# EAGLE design user_interface_bf_2.2.1 (EAGLE 7.7.0)
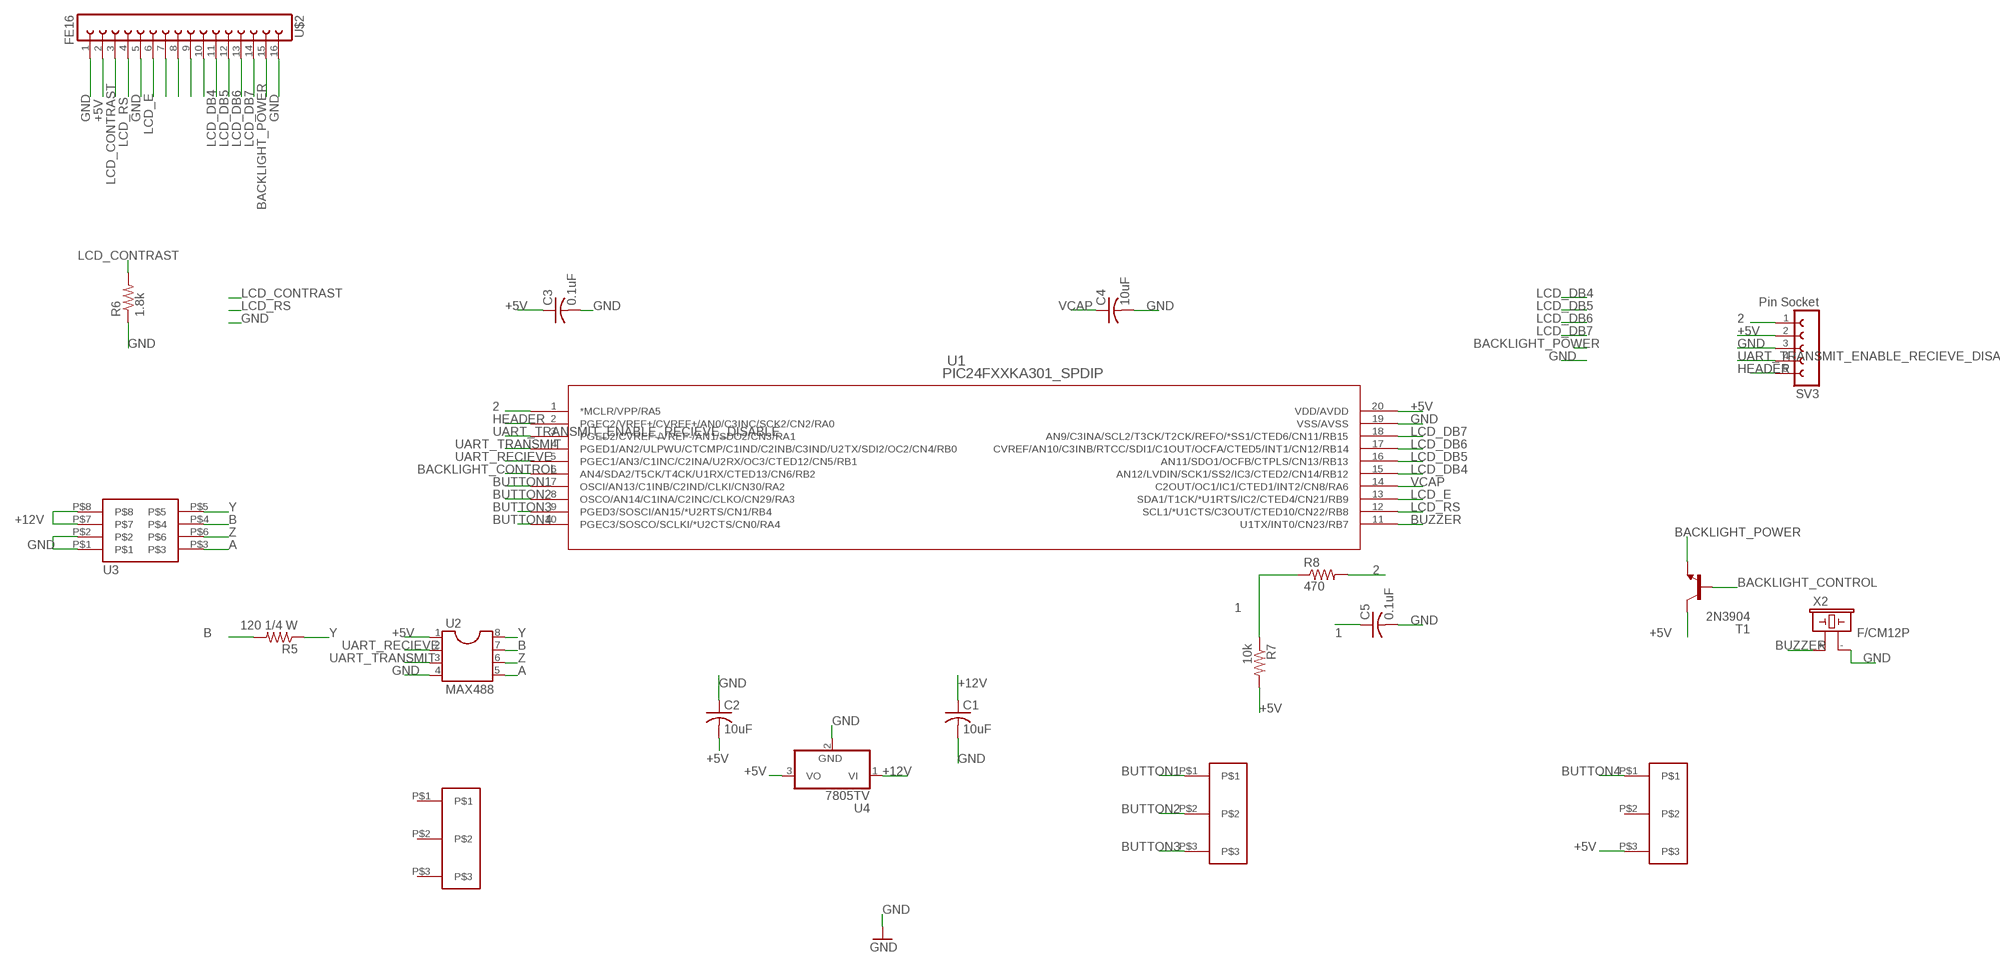
[diagram p0: schematic, sheet 1]

## Parts
C1  10uF  C-US050-025X075  [C050-025X075]
C2  10uF  C-US050-025X075  [C050-025X075]
C3  0.1uF  C-US050-025X075  [C050-025X075]
C4  10uF  C-US050-025X075  [C050-025X075]
C5  0.1uF  C-US050-025X075  [C050-025X075]
R5  120 1/4 W  R-US_0207/10  [0207/10]
R6  1.8k  R-US_0207/10  [0207/10]
R7  10k  R-US_0207/10  [0207/10]
R8  470  R-US_0207/10  [0207/10]
SV3  Pin Socket  FE05-1  [FE05-1]
T1  2N3904  [TO92]
U1  PIC24FXXKA301_SPDIP  [SPDIP20_300MC]
U2  MAX488  DIL8  [DIL08]
U3  CAT5  [CAT5]
U4  7805TV  [TO220V]
U6  3_PIN_FEMALE_HEADER  [3_PIN_FEMALE_HEADER]
U7  3_PIN_FEMALE_HEADER  [3_PIN_FEMALE_HEADER]
U$2  FE16  [FE16]
U$4  3_PIN_FEMALE_HEADER  [3_PIN_FEMALE_HEADER]
X2  F/CM12P  [F/CM12P]

## Nets
1: C5.1 R7.1 R8.1
2: R8.2 SV3.1 U1.1(*MCLR/VPP/RA5)
+5V: C2.2 C3.1 R7.2 SV3.2 T1.1(C) U1.20(VDD/AVDD) U2.1 U4.3(VO) U7.P$3 U$2.2
+12V: C1.1 U3.P$7 U3.P$8 U4.1(VI)
A: U2.5 U3.P$3
B: R5.2 U2.7 U3.P$4
BACKLIGHT_CONTROL: T1.2(B) U1.6(AN4/SDA2/T5CK/T4CK/U1RX/CTED13/CN6/RB2)
BACKLIGHT_POWER: T1.3(E) U$2.15
BUTTON1: U1.7(OSCI/AN13/C1INB/C2IND/CLKI/CN30/RA2) U6.P$1
BUTTON2: U1.8(OSCO/AN14/C1INA/C2INC/CLKO/CN29/RA3) U6.P$2
BUTTON3: U1.9(PGED3/SOSCI/AN15/*U2RTS/CN1/RB4) U6.P$3
BUTTON4: U1.10(PGEC3/SOSCO/SCLKI/*U2CTS/CN0/RA4) U7.P$1
BUZZER: U1.11(U1TX/INT0/CN23/RB7) X2.+
GND: C1.2 C2.1 C3.2 C4.2 C5.2 R6.1 SV3.3 U1.19(VSS/AVSS) U2.4 U3.P$1 U3.P$2 U4.2(GND) U$2.1 U$2.5 U$2.16 X2.-
HEADER: SV3.5 U1.2(PGEC2/VREF+/CVREF+/AN0/C3INC/SCK2/CN2/RA0)
LCD_CONTRAST: R6.2 U$2.3
LCD_DB4: U1.15(AN12/LVDIN/SCK1/SS2/IC3/CTED2/CN14/RB12) U$2.11
LCD_DB5: U1.16(AN11/SDO1/OCFB/CTPLS/CN13/RB13) U$2.12
LCD_DB6: U1.17(CVREF/AN10/C3INB/RTCC/SDI1/C1OUT/OCFA/CTED5/INT1/CN12/RB14) U$2.13
LCD_DB7: U1.18(AN9/C3INA/SCL2/T3CK/T2CK/REFO/*SS1/CTED6/CN11/RB15) U$2.14
LCD_E: U1.13(SDA1/T1CK/*U1RTS/IC2/CTED4/CN21/RB9) U$2.6
LCD_RS: U1.12(SCL1/*U1CTS/C3OUT/CTED10/CN22/RB8) U$2.4
N$12: U$2.10
N$13: U$2.9
N$14: U$2.8
N$15: U$2.7
UART_RECIEVE: U1.5(PGEC1/AN3/C1INC/C2INA/U2RX/OC3/CTED12/CN5/RB1) U2.2
UART_TRANSMIT: U1.4(PGED1/AN2/ULPWU/CTCMP/C1IND/C2INB/C3IND/U2TX/SDI2/OC2/CN4/RB0) U2.3
UART_TRANSMIT_ENABLE_RECIEVE_DISABLE: SV3.4 U1.3(PGED2/CVREF-/VREF-/AN1/SDO2/CN3/RA1)
VCAP: C4.1 U1.14(C2OUT/OC1/IC1/CTED1/INT2/CN8/RA6)
Y: R5.1 U2.8 U3.P$5
Z: U2.6 U3.P$6
Unconnected: U7.P$2 U$4.P$1 U$4.P$2 U$4.P$3

## Notes on the sheet
- U3

## Library data of the parts
C1-C5 = rcl:C-US: CAPACITOR, American symbol
R5-R8 = resistor:R-US_: RESISTOR, American symbol
SV3 = con-lsta:FE05-1: FEMALE HEADER; OC_FARNELL: unknown; OC_NEWARK: unknown
T1 = transistor:2N3904: NPN TRANSISTOR
U1 = KWHr Library:PIC24FXXKA301_SPDIP
U2 = ic-package:DIL8: Dual In Line / Socket
U3 = .KWHR Library:CAT5
U4 = linear:78*: Positive VOLTAGE REGULATOR Source: http://cache.national.com/ds/LM/LM78L05.pdf http://www.fairchildsemi.com/ds/LM/LM7805.pdf
U6 U7 U$4 = KWHr Library:3_PIN_FEMALE_HEADER
U$2 = con-lsta:FE16: FEMALE HEADER
X2 = buzzer:F/CM12P: BUZZER Source: Buerklin; OC_FARNELL: unknown; OC_NEWARK: unknown

## Board
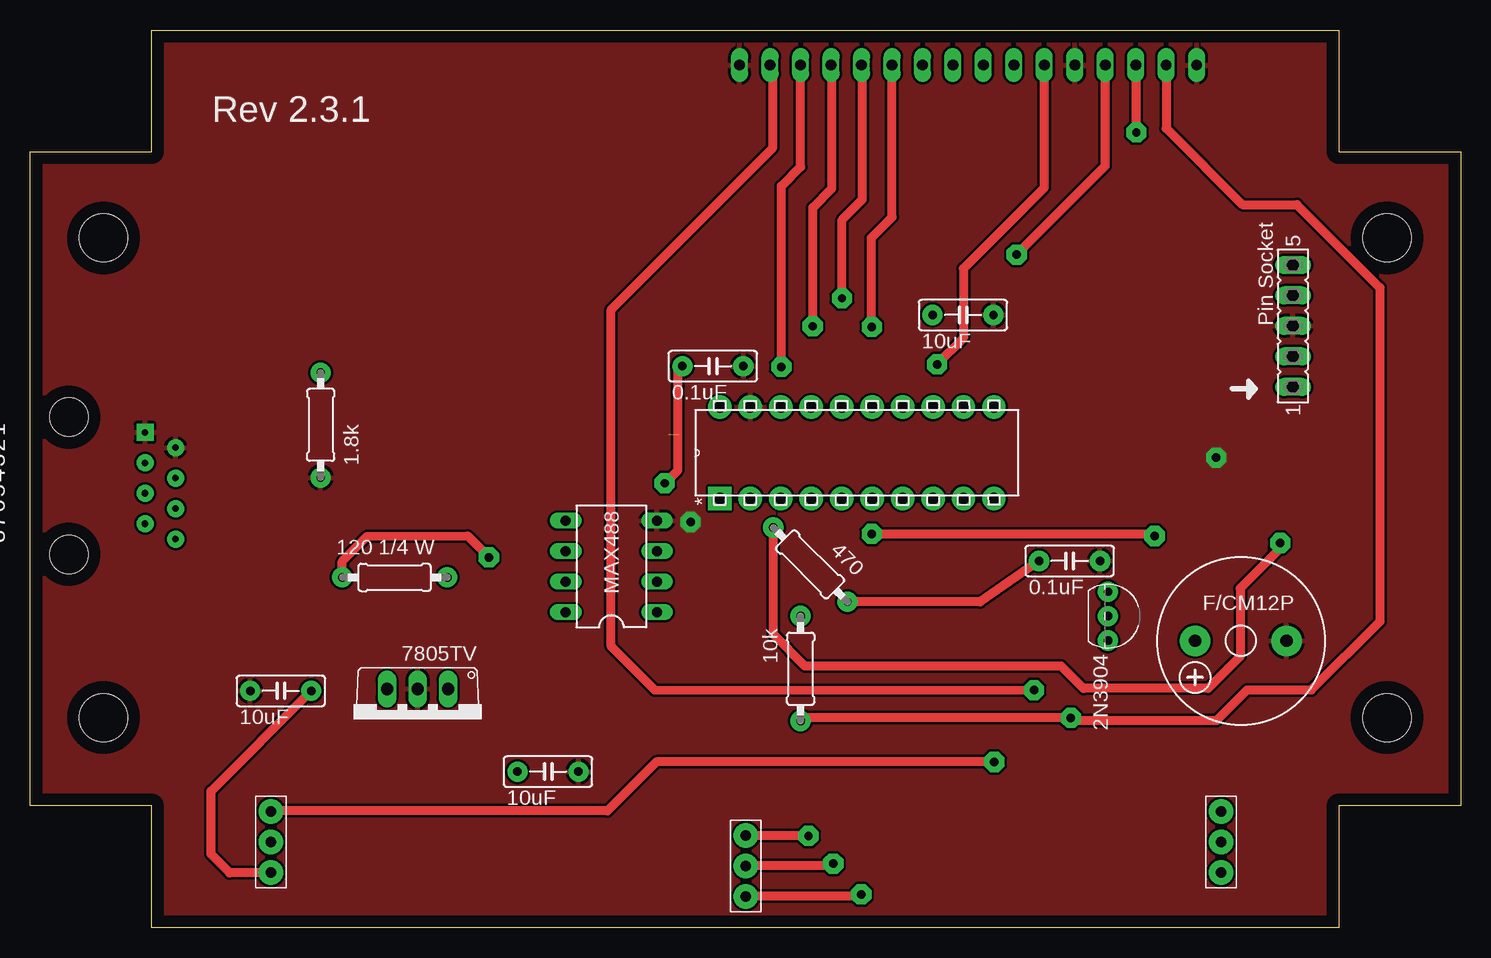
[diagram p1: board, top side]
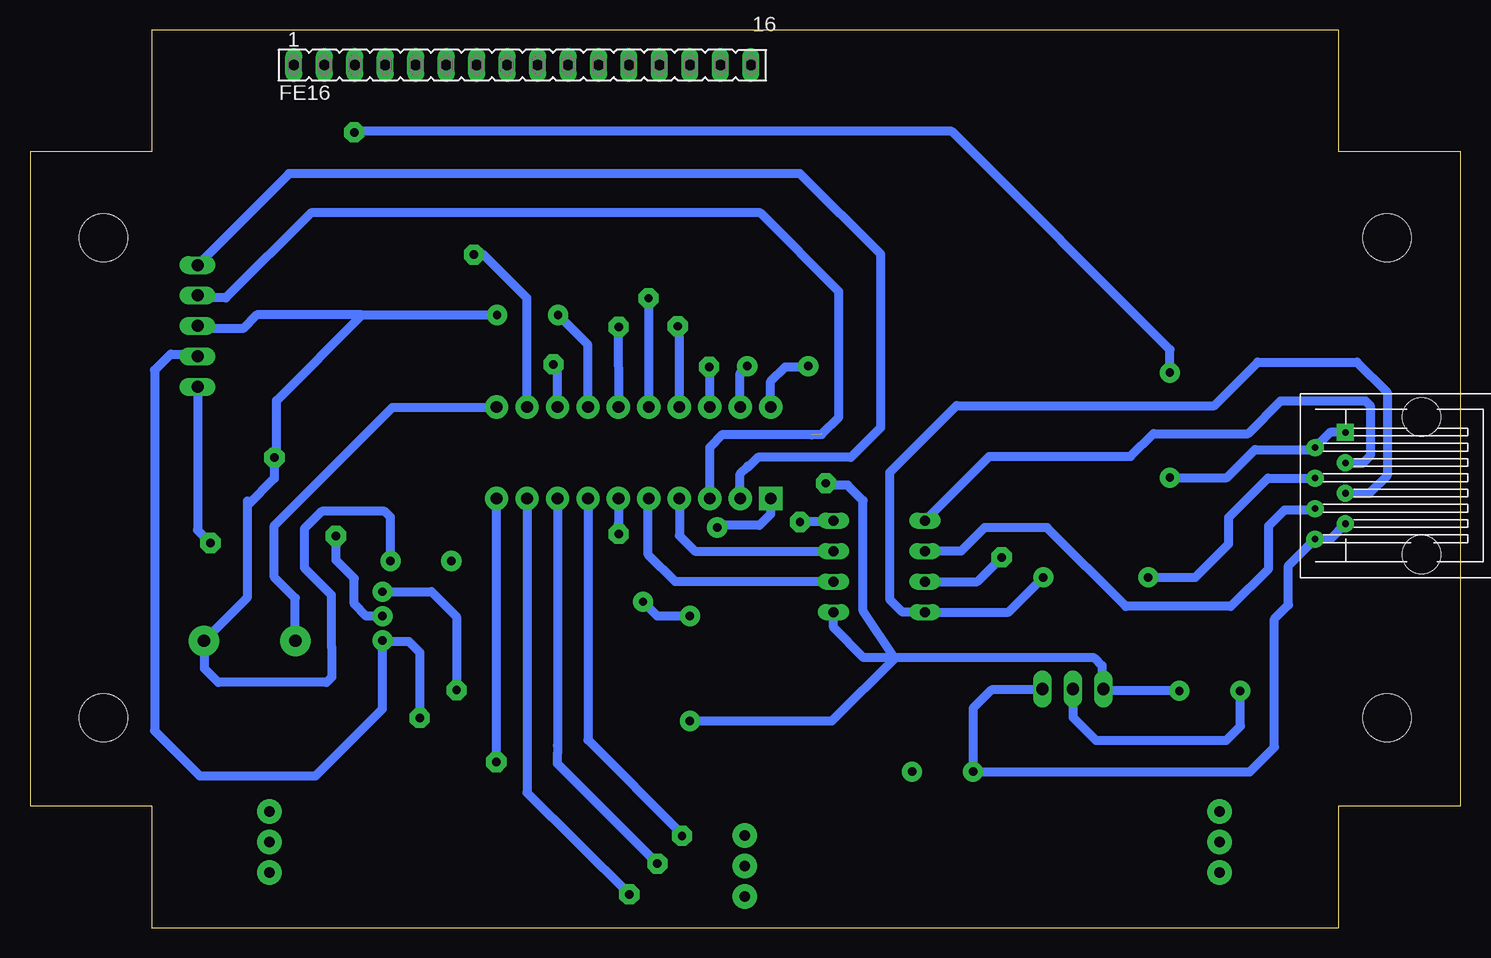
[diagram p2: board, bottom side, seen from below]

Size 119.25 x 74.8 mm. Coordinates in mm from the lower left corner, seen from the top.
Outline: 10.16,0 10.16,10.16 0,10.16 0,64.64 10.16,64.64 10.16,74.8 109.09,74.8 109.09,64.64 119.25,64.64 119.25,10.16 109.09,10.16 109.09,0 10.16,0
Copper layers (1*16): Top 0.035mm / dielectric 1.5mm / Bottom 0.035mm
Design rules "default": minimum track width 10mil, minimum drill 24mil, track to track 8mil, track to pad 8mil, pad to pad 8mil, via to via 8mil, smd to smd 8mil, copper to edge 40mil, drill to drill 8mil, minimum pad ring 10mil, minimum via ring 8mil, stop-mask expansion 4mil, vias tented up to drill 0mil, thermal gap 10mil
Holes 4 mm at 6.13,17.5 6.13,57.48 113.13,57.48 113.13,17.5

### Footprints (pad centres in the part's own frame; a part is rotated, then mirrored left to right if it is on the bottom)
C050-025X075 = drill 0.7 pad 1.676: 1 -2.54,0; 2 2.54,0
0207/10 = drill 0.7 pad 1.676: 1 -4.559,0; 2 4.191,0
FE05-1 = drill 1 long: 1 -5.08,0; 2 -2.54,0; 3 0,0; 4 2.54,0; 5 5.08,0
TO92 = drill 0.7 pad 1.676: 1 2.032,0; 2 0,0; 3 -2.032,0
SPDIP20_300MC = drill 0.991 pad 1.93 square: 1 -7.62,22.86 | drill 0.991 pad 1.93: 2 -7.62,20.32; 3 -7.62,17.78; 4 -7.62,15.24; 5 -7.62,12.7; 6 -7.62,10.16; 7 -7.62,7.62; 8 -7.62,5.08; 9 -7.62,2.54; 10 -7.62,0; 11 0,0; 12 0,2.54; 13 0,5.08; 14 0,7.62; 15 0,10.16; 16 0,12.7; 17 0,15.24; 18 0,17.78; 19 0,20.32; 20 0,22.86
DIL08 = drill 0.813 long: 1 -3.81,-3.81; 2 -1.27,-3.81; 3 1.27,-3.81; 4 3.81,-3.81; 5 3.81,3.81; 6 1.27,3.81; 7 -1.27,3.81; 8 -3.81,3.81
CAT5 = drill 0.56 pad 1.422 square: P$1 9.495,3.77 | drill 0.56 pad 1.422: P$2 8.225,1.23; P$3 6.955,3.77; P$4 5.685,1.23; P$5 4.415,3.77; P$6 3.145,1.23; P$7 1.875,3.77; P$8 0.605,1.23 | hole 3.2: -0.665,10.12; 10.765,10.12
TO220V = drill 1.016 long: 1 -2.54,-2.54; 2 0,-2.54; 3 2.54,-2.54
3_PIN_FEMALE_HEADER = drill 0.889 pad 2.032: P$1 0,0; P$2 2.54,0; P$3 5.08,0
FE16 = drill 0.9 long: 1 -25.4,2.54; 2 -22.86,2.54; 3 -20.32,2.54; 4 -17.78,2.54; 5 -15.24,2.54; 6 -12.7,2.54; 7 -10.16,2.54; 8 -7.62,2.54; 9 -5.08,2.54; 10 -2.54,2.54; 11 0,2.54; 12 2.54,2.54; 13 5.08,2.54; 14 7.62,2.54; 15 10.16,2.54; 16 12.7,2.54
F/CM12P = drill 1.016 pad 2.54: + 3.81,0; - -3.81,0

### Placement (x,y rotation side)
C1  43.18,13 0 top
C2  20.9,19.74 0 top
C3  56.92,46.79 0 top
C4  77.77,51.05 0 top
C5  86.66,30.56 0 top
R5  30.23,29.18 180 top
R6  24.23,42.06 90 top
R7  64.24,21.41 270 top
R8  64.92,30.38 135 top
SV3  105.28,50.14 90 top
T1  89.87,25.96 270 top
U1  80.37,43.38 90 top
U2  48.46,30.1 90 top
U3  13.36,31.78 90 top
U4  32.31,17.35 180 top
U6  59.68,7.68 270 top
U7  20.07,9.68 270 top
U$2  71.86,69.34 0 bottom
U$4  99.3,9.68 270 top
X2  100.94,23.9 180 top

### Tracks (layer width: path | path; a pad name or v marks a point on that pad's centre or on a via)
1
  Top 0.762: C5.1 79.2,27.15 R8.1
  Bottom 0.762: R8.1 66.96,25.97 R7.1
2  (via drill 0.7 pad 1.68)
  Top 0.762: v104.22,32.05 104.44,31.83 100.89,28.27 100.89,22.61 98.22,19.94 87.83,19.94 85.98,21.79 64.62,21.79 61.96,24.45 R8.2
  Bottom 0.762: SV3.1 105.28,33.12 v104.22,32.05 | U1.1 57.51,34.47 58.45,33.53 61.77,33.53 R8.2
+5V  (via drill 0.7 pad 1.68)
  Top 0.406: U7.P$3 20.34,4.6 20.34,4.57
  Top 0.762: v52.91,37.03 54,38.12 54,46.41 C3.1 | R7.2 64.49,17.48 v86.77,17.48 87,17.25 98.91,17.25 101.47,19.81 106.83,19.81 112.52,25.5 112.52,53.34 105.61,60.25 101.07,60.25 94.72,66.6 U$2.2 | 20.34,4.57 16.64,4.57 15.09,6.12 15.09,11.38 C2.2
  Bottom 0.762: 47.12,22.5 47.19,22.5 | 47.19,22.5 49.76,22.5 52.27,25.02 U2.1 | 47.19,22.5 49.81,26.39 49.81,35.59 51.1,36.88 52.76,36.88 v52.91,37.03 | 47.12,22.5 47.09,22.48 30.53,22.48 29.9,21.84 29.9,20.02 U4.3 29.62,19.74 C2.2 | R7.2 52.4,17.22 47.12,22.5 | U1.20 57.51,45.52 56.29,46.74 54.43,46.74 C3.1 | v86.77,17.48 86.77,22.94 87.68,23.85 89.79,23.85 T1.1 89.86,18.24 95.45,12.65 105.11,12.65 108.86,16.41 108.86,46.46 107.52,47.8 105.49,47.8 SV3.2
+12V
  Bottom 0.762: U4.1 34.92,19.81 39.09,19.81 40.64,18.26 C1.1 40.62,12.98 17.58,12.98 15.52,15.04 15.52,25.73 14.35,26.9 14.35,30.16 U3.P$8 10.86,32.38 U3.P$7
A
  Bottom 0.762: U2.5 39.29,39.27 27.51,39.27 25.6,41.17 17.7,41.17 14.99,43.89 7.92,43.89 7.54,43.51 7.54,39.32 8.2,38.66 9.52,38.66 U3.P$3
B  (via drill 0.7 pad 1.68)
  Top 0.762: v38.25,30.86 36.47,32.64 28.12,32.61 26.04,30.53 R5.2
  Bottom 0.762: U2.7 40.28,28.83 v38.25,30.86 | R5.2 22.12,29.18 19.33,31.98 19.33,34.19 16.05,37.47 U3.P$4
BACKLIGHT_CONTROL  (via drill 0.7 pad 1.68)
  Top 0.762: v70.18,32.82 93.57,32.82 v93.75,32.64
  Bottom 0.762: U1.6 70.21,33.66 v70.18,32.82 | 93.65,32.54 v93.75,32.64 93.75,30.63 92.23,29.11 92.23,26.98 91.21,25.96 T1.2
BACKLIGHT_POWER  (via drill 0.7 pad 1.68)
  Top 0.762: v83.69,19.79 52.07,19.81 48.44,23.44 48.44,51.51 61.92,65 61.92,71.65 U$2.15
  Bottom 0.762: T1.3 85.78,27.99 83.69,25.91 v83.69,19.79
BUTTON1  (via drill 0.7 pad 1.68)
  Top 0.762: v64.9,7.64 64.86,7.68 U6.P$1
  Bottom 0.762: U1.7 72.75,15.65 64.9,7.8 v64.9,7.64
BUTTON2  (via drill 0.7 pad 1.68)
  Top 0.762: v66.95,5.33 66.76,5.14 U6.P$2
  Bottom 0.762: U1.8 75.29,15.16 75.29,14.5 75.29,13.66 v66.95,5.33
BUTTON3  (via drill 0.7 pad 1.68)
  Top 0.762: v69.29,2.77 69.12,2.6 U6.P$3
  Bottom 0.762: U1.9 77.83,11.25 v69.29,2.77
BUTTON4  (via drill 0.7 pad 1.68)
  Top 0.762: v80.37,13.82 52.22,13.82 48.13,9.73 20.12,9.73 U7.P$1
  Bottom 0.762: U1.10 v80.37,13.82 v80.39,13.79 80.39,13.84 80.42,13.87
BUZZER
  Bottom 0.762: X2.+ 97.13,27.46 98.88,29.21 98.88,33.5 89.03,43.36 80.39,43.36 U1.11 80.42,43.43
GND  (via drill 0.7 pad 1.68)
  Bottom 0.762: U2.4 52.38,33.81 v55.07,33.81 | 32.36,19.94 U4.2 32.31,17.53 30.38,15.6 19.53,15.6 18.34,16.79 18.34,19.71 C2.1 | X2.- 101.12,27.53 101.12,35.2 | 104.67,23.82 X2.- | X2.- 104.7,23.85 104.7,21.59 103.56,20.45 94.54,20.45 94.08,20.9 94.08,23.34 94.13,23.39 94.13,27.74 96.39,30 96.39,33.22 94.92,34.7 89.69,34.7 89.2,34.21 C5.2 | 91.57,51.05 98.7,43.92 98.7,39.17 v98.88,39.17 | U3.P$1 10.86,41.27 U3.P$2 12.3,39.83 17.14,39.83 19.47,37.5 R6.1 | U1.19 60.05,46.2 C3.2 | 101.12,35.2 101.12,35.53 | 98.81,39.24 v98.88,39.17 | v98.88,39.17 98.88,37.44 101.12,35.2 | 91.57,51.05 C4.2 | 91.57,51.05 100.36,51.05 101.5,49.91 105.05,49.91 SV3.3
  pour Top: 10.19,74.8 109.09,74.8 109.09,64.64 119.25,64.64 119.25,10.16 109.09,10.16 109.09,0 10.16,0 10.16,10.16 0,10.16 0,64.64 10.19,64.64
HEADER
  Bottom 0.762: U1.2 60.05,37.82 59.41,38.46 59.36,38.41 58.57,39.19 50.83,39.19 48.34,41.68 48.34,56.11 55.07,62.84 56.87,62.84 57,62.84 97.66,62.84 SV3.5
LCD_CONTRAST  (via drill 0.7 pad 1.68)
  Top 0.762: U$2.3 92.18,66.32 v92.23,66.27
  Bottom 0.762: R6.2 24.23,48.16 42.42,66.34 92.15,66.34 v92.23,66.27
LCD_DB4  (via drill 0.7 pad 1.68)
  Top 0.762: U$2.11 71.86,59.21 70.13,57.48 70.13,50.11 v70.18,50.06
  Bottom 0.762: U1.15 70.13,43.38 v70.18,50.06
LCD_DB5  (via drill 0.7 pad 1.68)
  Top 0.762: v67.69,52.45 67.69,58.98 69.39,60.68 69.39,71.81 U$2.12
  Bottom 0.762: U1.16 67.67,52.43 v67.69,52.45
LCD_DB6  (via drill 0.7 pad 1.68)
  Top 0.762: v65.25,50.11 65.25,59.99 66.85,61.59 66.85,71.81 U$2.13
  Bottom 0.762: 65.2,43.38 U1.17 65.13,49.99 v65.25,50.11
LCD_DB7  (via drill 0.7 pad 1.68)
  Top 0.762: v62.64,46.74 62.64,61.8 64.24,63.4 U$2.14
  Bottom 0.762: 62.56,43.38 U1.18 62.56,43.41 62.56,46.66 v62.64,46.74
LCD_E  (via drill 0.7 pad 1.68)
  Top 0.762: v75.62,46.94 77.8,49.12 77.8,54.91 84.56,61.67 U$2.6
  Bottom 0.762: U1.13 75.29,46.61 v75.62,46.94
LCD_RS  (via drill 0.7 pad 1.68)
  Top 0.762: v82.25,56.08 89.64,63.48 U$2.4
  Bottom 0.762: U1.12 77.83,52.45 81.46,56.08 v82.25,56.08
UART_RECIEVE
  Bottom 0.762: U1.5 67.72,35.71 67.72,31.09 65.46,28.83 U2.2
UART_TRANSMIT
  Bottom 0.762: U1.4 65.13,32.66 63.83,31.37 U2.3
UART_TRANSMIT_ENABLE_RECIEVE_DISABLE  (1 unrouted)
  Bottom 0.762: U1.3 62.59,40.03 61.52,41.1 53.26,41.1 51.82,42.55 51.82,53.01 58.37,59.56 95.83,59.56 102.92,52.48 105.08,52.48 SV3.4 | 54.13,41.1 54.1,41.07
VCAP
  Bottom 0.762: U1.14 72.75,48.56 C4.1
Y
  Bottom 0.762: R5.1 37.68,26.29 U2.8 46.51,26.29 47.6,27.38 47.6,37.92 42.01,43.51 20.52,43.51 16.92,47.12 8.64,47.12 6.12,44.6 6.12,37.67 7.6,36.19 U3.P$5
Z
  Bottom 0.762: U2.6 41.63,31.37 39.67,33.33 34.47,33.33 27.91,26.77 19.15,26.77 16,29.92 16,33.48 14.66,34.82 12.23,34.82 U3.P$6

### Text on the board
tPlace: Rev 2.3.1